# Altium schematic sheet nRF52832.SchDoc
size A
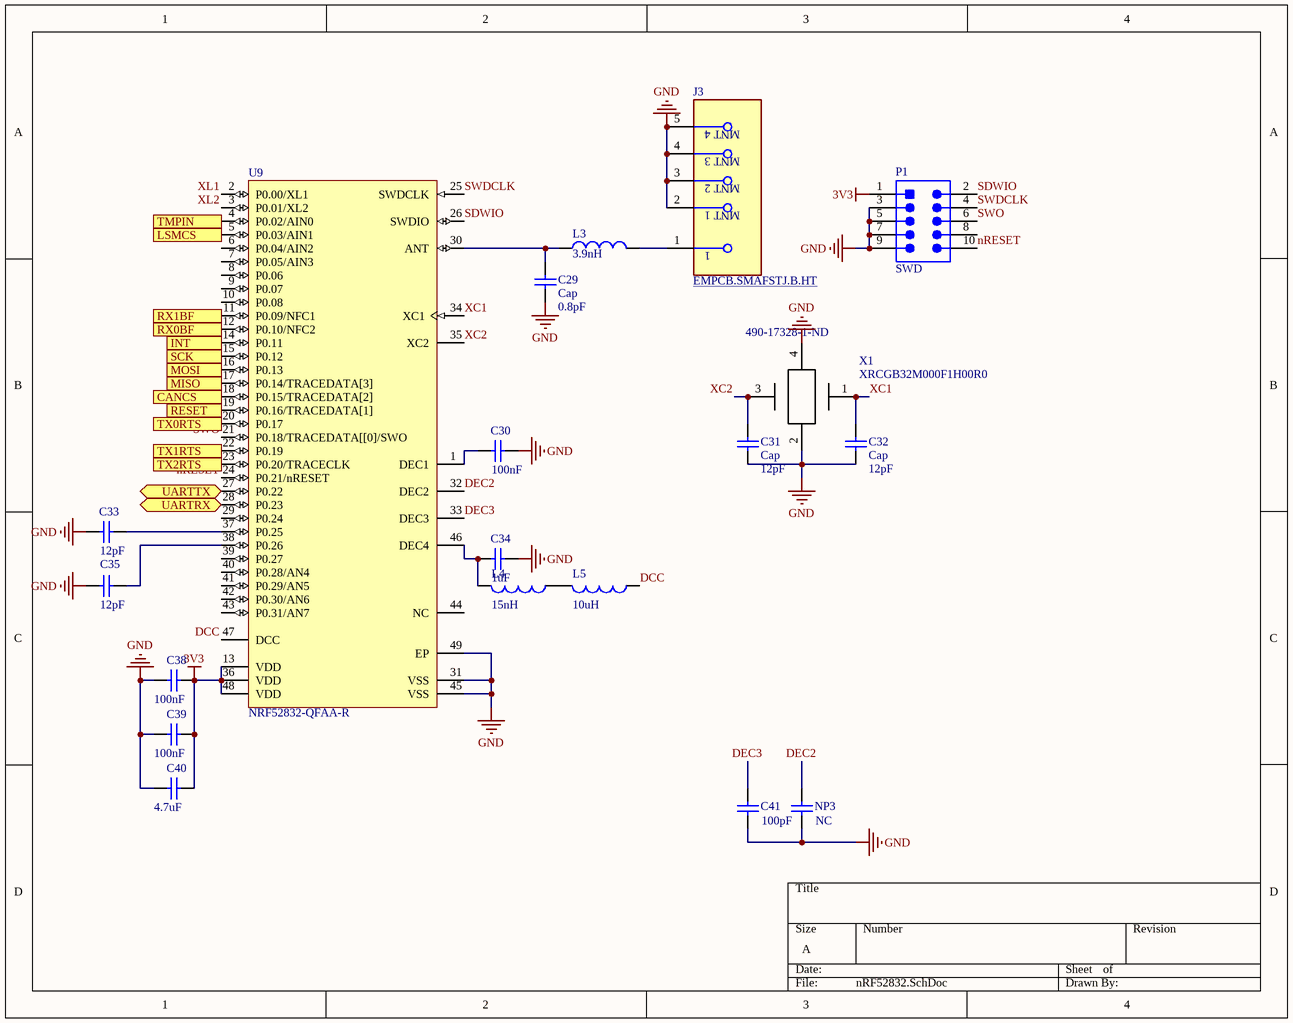
[diagram p0: nRF52832.SchDoc]

## Parts
C29  Cap  value 0.8pF  [0402-A]
C30  value 100nF  [0402-A]  (hidden comment: Cap)
C31  Cap  value 12pF  [0402-A]
C32  Cap  value 12pF  [0402-A]
C33  value 12pF  [0402-A]  (hidden comment: Cap)
C34  value 1uF  [1608[0603]]  (hidden comment: Cap)
C35  value 12pF  [0402-A]  (hidden comment: Cap)
C38  value 100nF  [0402-A]  (hidden comment: Cap)
C39  value 100nF  [0402-A]  (hidden comment: Cap)
C40  value 4.7uF  [6-0805_M]  (hidden comment: Cap)
C41  value 100pF  [0402-A]  (hidden comment: Cap)
J3  EMPCB.SMAFSTJ.B.HT  [FP-EMPCB_SMAFSTJ_B_HT-MFG]
L3  value 3.9nH  [0402-A]  (hidden comment: Inductor)
L4  value 15nH  [0402-A]  (hidden comment: Inductor)
L5  value 10uH  [1608[0603]]  (hidden comment: Inductor)
NP3  value NC  [0402-A]  (hidden comment: Cap)
P1  SWD  [SMTC-FTSH-105-01-L-DV-K_V]
U9  NRF52832-QFAA-R  [NRSC-QF-48_M]
X1  XRCGB32M000F1H00R0  Supplier Part Number 1: 490-17328-1-ND  [XRCGB32M000F1H00R0]

## Ports
CANCS (out), INT (in), LSMCS (out), MISO (in), MOSI (out), RESET (out), RX0BF (in), RX1BF (in), SCK (out), TMPIN (in), TX0RTS (out), TX1RTS (out), TX2RTS (out), UARTRX (bidir), UARTTX (bidir)

## Nets
3V3: C38.1 C39.1 C40.1 P1.1 U9.13(VDD) U9.36(VDD) U9.48(VDD)
GND: C29.1 C30.1 C31.1 C32.1 C33.2 C34.1 C35.2 C38.2 C39.2 C40.2 C41.1 J3.2(MNT_1) J3.3(MNT_2) J3.4(MNT_3) J3.5(MNT_4) NP3.1 P1.3 P1.5 P1.7 P1.9 U9.31(VSS) U9.45(VSS) U9.49(EP) X1.2 X1.4
CANCS: U9.18(P0.15/TRACEDATA[2]) ; port CANCS
DCC: L5.1 U9.47(DCC)
DEC2: NP3.2 U9.32(DEC2)
DEC3: C41.2 U9.33(DEC3)
INT: U9.14(P0.11) ; port INT
LSMCS: U9.5(P0.03/AIN1) ; port LSMCS
MISO: U9.17(P0.14/TRACEDATA[3]) ; port MISO
MOSI: U9.16(P0.13) ; port MOSI
nRESET: P1.10 U9.24(P0.21/nRESET)
RESET: U9.19(P0.16/TRACEDATA[1]) ; port RESET
RX0BF: U9.12(P0.10/NFC2) ; port RX0BF
RX1BF: U9.11(P0.09/NFC1) ; port RX1BF
SCK: U9.15(P0.12) ; port SCK
SDWIO: P1.2 U9.26(SWDIO)
SWDCLK: P1.4 U9.25(SWDCLK)
SWO: P1.6 U9.21(P0.18/TRACEDATA[[0]/SWO)
TMPIN: U9.4(P0.02/AIN0) ; port TMPIN
TX0RTS: U9.20(P0.17) ; port TX0RTS
TX1RTS: U9.22(P0.19) ; port TX1RTS
TX2RTS: U9.23(P0.20/TRACECLK) ; port TX2RTS
UARTRX: U9.28(P0.23) ; port UARTRX
UARTTX: U9.27(P0.22) ; port UARTTX
XC1: C32.2 U9.34(XC1) X1.1
XC2: C31.2 U9.35(XC2) X1.3
XL1: U9.2(P0.00/XL1)
XL2: U9.3(P0.01/XL2)
NetC29_2: C29.2 L3.1 U9.30(ANT)
NetC30_2: C30.2 U9.1(DEC1)
NetC33_1: C33.1 U9.37(P0.25)
NetC34_2: C34.2 L4.2 U9.46(DEC4)
NetC35_1: C35.1 U9.38(P0.26)
NetJ3_1: J3.1 L3.2
NetL4_1: L4.1 L5.2

Not connected (* = marked no-connect by the designer): P1 8; U9 6(P0.04/AIN2) 7(P0.05/AIN3) 8(P0.06) 9(P0.07) 10(P0.08) 29(P0.24) 39(P0.27) 40(P0.28/AN4) 41(P0.29/AN5) 42(P0.30/AN6) 43(P0.31/AN7) 44(NC)

## Library data of the parts
C29-C35 C38-C41 NP3 = Cap: Capacitor; Published: 8-Jun-2000; LatestRevisionDate: 17-Jul-2002; LatestRevisionNote: Re-released for DXP Platform.; PackageReference: RAD-0.3; Publisher: Altium Limited; PackageDescription: Radial Cap, Thru-Hole; 2 Leads; 0.3 in Pin Spacing
J3 = CMP-111093-000001-1: CONN SMA JACK STR 50OHM EDGE MNT; Manufacturer: Taoglas Limited; Conn Orientation: Horizontal; Frequency: 12.4GHz; Impedance: 50Ω; Voltage Rating: 335V; Is Female: yes; Pitch: 2.62mm; Number Of Contacts: 1; Device Class L2: RF / Coaxial Connectors; Category: Conn; Contact Material: Gold; Device Class L1: Connectors; Digikey Description: CONN SMA JACK STR 50OHM EDGE MNT; Temperature Range Low: -40°C; Octopart: https://octopart.com/empcb.smafstj.b.ht-taoglas-24204431; ComponentLink2URL: https://cdn.taoglas.com/datasheets/EMPCB.SMAFSTJ.B.HT.pdf; Temperature Range High: +85°C; Device Class L3: unset; Temperature: -40°C to +85°C; Package: 0; RoHS: TRUE; Lead Free: Yes; Automotive: No; ComponentLink2Description: Datasheet; Mouser Description: RF Connectors / Coaxial Connectors SMA Straight Edge Mount PCB Jack-Gold; Manufacturer Part Number: EMPCB.SMAFSTJ.B.HT
L3-L5 = Inductor: Code_IEC: 1005; Published: 8-Jun-2000; LatestRevisionDate: 29-May-2009; LatestRevisionNote: IPC-7351 Footprint Added.; PackageReference: 0402-A; Publisher: Altium Limited; PackageDescription: Chip Inductor; Code_JEITA: 0402
P1 = CMP-2000-05353-1: Male Header, Pitch 1.27 mm, 2 x 5 Position, Height 6.25 mm; Manufacturer: Samtec; Pitch: 0.050"(1.27mm); Other Names: Q3937619; Number of Positions: 10; Mating Products: SFMC-105-L2-S-D-TR-ND / -CONN.05"SURFACE10POSSMT / FLE-105-01-G-DV-TR-ND / -CONNSKT1.27MM10POSDUALSMD / FLE-105-01-G-DV-A-P-ND / -CONNSKT1.27MM10POSDUALSMD / FLE-105-01-G-DV-A-ND / -CONNSKT1.27MM10POSDUALSMD / CLP-105-02-G-D-P-TR-ND / -CONNRCPT10POSDUAL.05"SMD / SAM1155-05-ND / -CONNRCPT10POSDUAL.05"SMD / SAM1154-05-ND / -CONNRCPT10POSDUAL.05"SMD / SAM1153-05-ND / -CONNRCPT10POSDUAL.05"SMD / SAM1226-05-ND / -CONNRCPT.05"10POSDUALSMD; Number of Positions Loaded: All; Connector Type: Header,Unshrouded; Product Training Modules: Board-to-BoardConnectors; Datasheet Version: Rev. ET, 10/1995; Number of Rows: 2; Standard Package: 1; Package Description: Male Header, Pitch 1.27 mm, 2 x 5 Position, Height 5.97 mm, Tail Length 4.32 mm; Contact Finish Thickness: 10µin(0.25µm); Series: FTSH; Termination: Solder; Contact Type: MalePin; Color: Black; Package Reference: FTSH-105-01-L-DV-K; Family: RectangularConnectors-Headers,MalePins; Package URL: http://suddendocs.samtec.com/prints/ftsh-1xx-xx-xxx-dv-xxx-footprint.pdf; Packaging: Tube; Mounting Type: SurfaceMount; Category: Connectors,Interconnects; Datasheet URL: http://suddendocs.samtec.com/prints/ftsh-1xx-xx-xxx-dv-xxx-mkt.pdf; Row Spacing: 0.050"(1.27mm); Manufacturer URL: http://www.samtec.com/; Contact Mating Length: 0.120"(3.05mm); Contact Finish: Gold
U9 = CMP-2100-03661-1: Multiprotocol Bluetooth Smart, ANT/ANT+ and Proprietary System-on-Chip, 2.4 GHz, 256 KB FLASH, 1.7 to 3.6 V, -40 to 85 degC, 48-Pin QFN, RoHS, Tape and Reel; Manufacturer: Nordic Semiconductor; Frequency: 2.4GHz; Datasheet Version: Rev. 1.0, 02/2016; Datasheet URL: http://infocenter.nordicsemi.com/pdf/nRF52832_PS_v1.0.pdf; Mount: SurfaceMount; Max Operating Temperature: 85degC; Manufacturer URL: http://www.nordicsemi.com/eng/Products/; Lead Free: LeadFree; Min Operating Temperature: -40degC; RoHSCompliant: true; Package Reference: QF-48; Package Description: 48-Pin Quad Flat No-lead Package, Body 6 x 6 mm, Pitch 0.4 mm, Thermal Pad 4.6 x 4.6 mm; Max Frequency: 2.4GHz; Packaging: TapeandReel
X1 = XRCGB32M000F1H00R0: 32MHz Crystal Oscillator; Supplier 1: Digi-Key